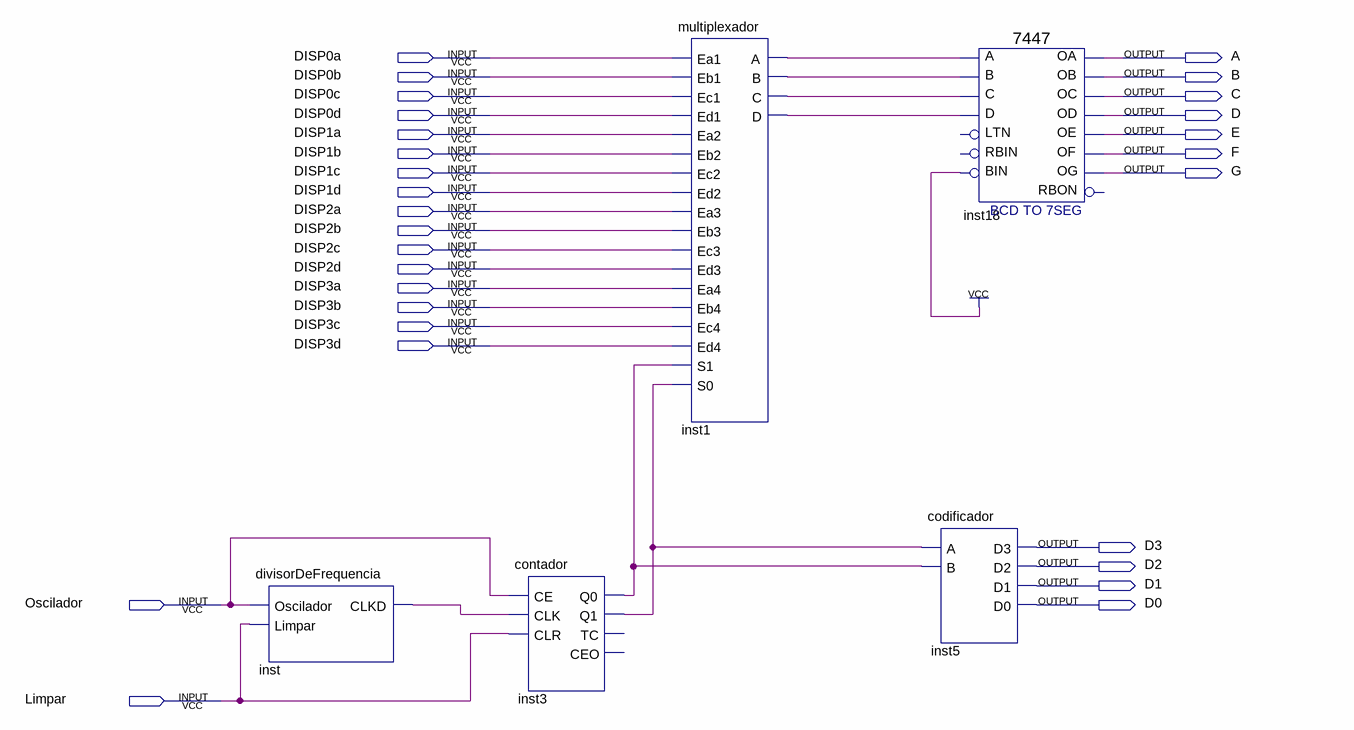
[diagram p0: schematic sheet]
// Quartus schematic figura1.bdf as structural Verilog: 5 symbols, 29 pins
module figura1 (
  input  DISP0a,
  input  DISP0b,
  input  DISP0c,
  input  DISP0d,
  input  DISP1a,
  input  DISP1b,
  input  DISP1c,
  input  DISP1d,
  input  DISP2a,
  input  DISP2b,
  input  DISP2c,
  input  DISP2d,
  input  DISP3a,
  input  DISP3b,
  input  DISP3c,
  input  DISP3d,
  input  Oscilador,
  input  Limpar,
  output A,
  output B,
  output C,
  output D,
  output E,
  output F,
  output G,
  output D3,
  output D2,
  output D1,
  output D0
);

  wire inst1_a, inst1_b, inst1_c, inst1_d, inst3_q0, inst3_q1, inst_clkd;

  divisorDeFrequencia inst (.Oscilador(Oscilador), .Limpar(Limpar), .CLKD(inst_clkd));
  contador inst3 (.CE(Oscilador), .CLK(inst_clkd), .CLR(Limpar), .Q0(inst3_q0), .Q1(inst3_q1));  // open: TC, CEO
  multiplexador inst1 (
    .Ea1(DISP0a), .Eb1(DISP0b), .Ec1(DISP0c), .Ed1(DISP0d), .Ea2(DISP1a), .Eb2(DISP1b), .Ec2(DISP1c),
    .Ed2(DISP1d), .Ea3(DISP2a), .Eb3(DISP2b), .Ec3(DISP2c), .Ed3(DISP2d), .Ea4(DISP3a), .Eb4(DISP3b),
    .Ec4(DISP3c), .Ed4(DISP3d), .S1(inst3_q0), .S0(inst3_q1), .A(inst1_a), .B(inst1_b), .C(inst1_c),
    .D(inst1_d));
  \7447  inst18 (
    .B(inst1_b), .C(inst1_c), .D(inst1_d), .BIN(1'b1), .A(inst1_a), .OB(B), .OC(C), .OE(E), .OD(D), .OF(F),
    .OG(G), .OA(A));  // open: LTN, RBIN, RBON
  codificador inst5 (.A(inst3_q1), .B(inst3_q0), .D3(D3), .D2(D2), .D1(D1), .D0(D0));
endmodule
